# EasyEDA schematic schematic.easyeda.json
TITLE: Lunatic MIDI: PIC logic module; REV: 1.0; Date: 2019-03-29; Sheet: 1/1; Drawn By: Marco Zaccari; Company: Lunatic Electronics
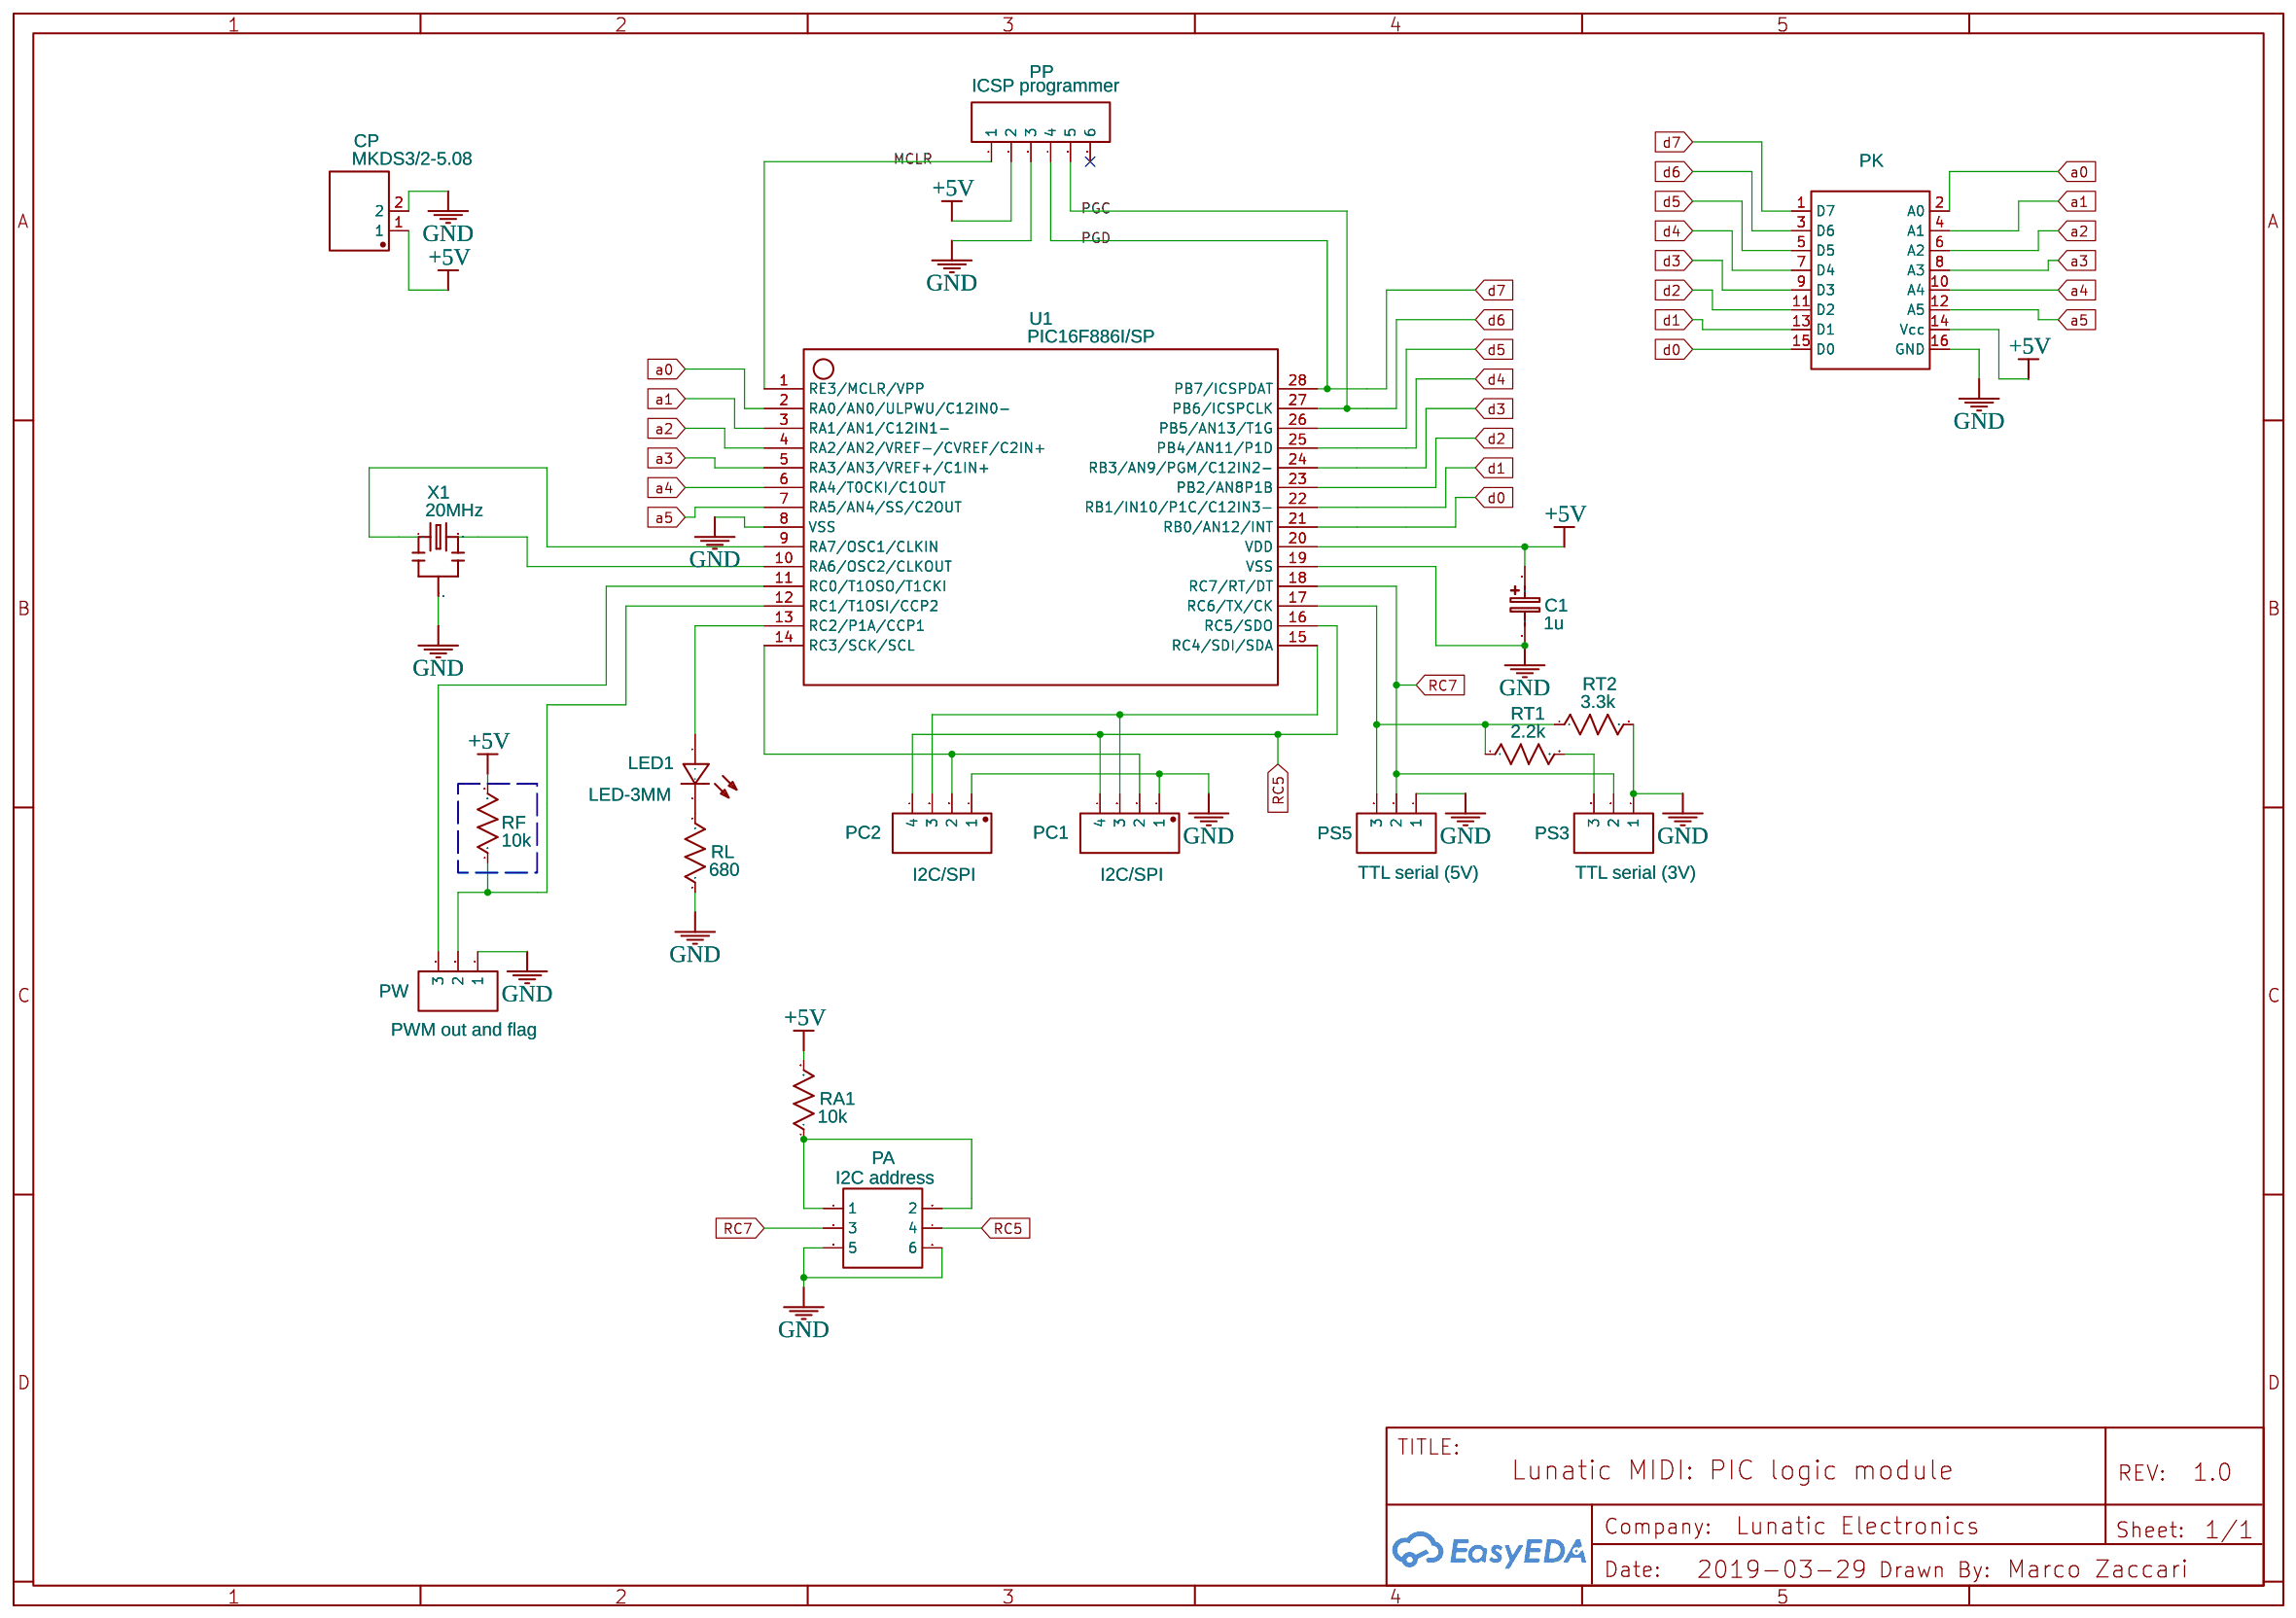
[diagram p0: schematic sheet]

## Parts
C1  1u  [CAP-D3.0XF1.5]
CP  MKDS3/2-5.08  [MKDS3/2-5.08]
LED1  LED-3MM  [LED-3MM/2.54]
PA  I2C address  [HDR-3X2/2.54]
PC1  I2C/SPI  [DIP-1X4P-2.54MM-M]
PC2  I2C/SPI  [DIP-1X4P-2.54MM-M]
PK  Lunatic MCU connector  [HDR-8X2/2.54]
PP  ICSP programmer  [HDR-6X1/2.54]
PS3  TTL serial (3V)  [HDR-3X1/2.54]
PS5  TTL serial (5V)  [HDR-3X1/2.54]
PW  PWM out and flag  [HDR-3X1/2.54]
RA1  10k  [AXIAL-0.3]
RF  10k  [AXIAL-0.3]
RL  680  [AXIAL-0.3]
RT1  2.2k  [AXIAL-0.3]
RT2  3.3k  [AXIAL-0.3]
U1  PIC16F886I/SP  [DIP-28_300MIL]
X1  20MHz  [RESONATOR-PTH]

## Library data of the parts
C1 = Cap_Electrolytic(TH)_D3.0XF1.5_EU: Contributor: EasyEDA; Manufacturer Part: ?
CP = -: Supplier: LCSC; Manufacturer: Phoenix Contact; Supplier Part: C89120
LED1 = -: Supplier Part: C99772; Supplier: LCSC; Manufacturer: EVERLIGHT; Manufacturer Part: 204-10SURD/S530-A3
PA = -: Supplier: LCSC; Manufacturer: BOOMELE; Manufacturer Part: Header-Male-2.54_2x3; Supplier Part: C65114
PC1 PC2 = -: Supplier: LCSC; Manufacturer: Ckmtw; Manufacturer Part: 210S-1*4P L=11.6MMGold-plated black; Contributor: LCSC; Supplier Part: C124378
PK = -: Manufacturer Part: GEM; image: //image.lceda.cn/szlcsc/C30734.jpg
PP = -: Supplier: LCSC; Manufacturer: BOOMELE; Manufacturer Part: Header-Male-2.54_1x6; Supplier Part: C37208
PS3 PS5 PW = -: Supplier: LCSC; Manufacturer: BOOMELE; Manufacturer Part: Header2.54mm 1*3P; image: //image.lceda.cn/szlcsc/C49257.jpg; Supplier Part: C49257
RA1 RF RL RT1 RT2 = Res_AXIAL-0.3(1/8W)_US: Manufacturer Part: ?
U1 = -: Supplier: LCSC; Manufacturer: MICROCHIP; image: //image.lceda.cn/szlcsc/C46335.jpg; Contributor: LCSC; Supplier Part: C46335
X1 = RESONATOR 433.92MHZ: Supplier: LCSC; Manufacturer: YXC; Manufacturer Part: Resonator 433.92MHZ; Contributor: LCSC; Supplier Part: C71016

## Nets
+5V: C1.1 CP.1 PK.14(Vcc) PP.2 RA1.2 RF.2 U1.20(VDD)
GND: C1.2 CP.2 PA.5 PA.6 PC1.1 PC2.1 PK.16(GND) PP.3 PS3.1 PS5.1 PW.1 RL.1 RT2.2 U1.8(VSS) U1.19(VSS) X1.2
a0: PK.2(A0) U1.2(RA0/AN0/ULPWU/C12IN0-)
a1: PK.4(A1) U1.3(RA1/AN1/C12IN1-)
a2: PK.6(A2) U1.4(RA2/AN2/VREF-/CVREF/C2IN+)
a3: PK.8(A3) U1.5(RA3/AN3/VREF+/C1IN+)
a4: PK.10(A4) U1.6(RA4/T0CKI/C1OUT)
a5: PK.12(A5) U1.7(RA5/AN4/SS/C2OUT)
d0: PK.15(D0) U1.21(RB0/AN12/INT)
d1: PK.13(D1) U1.22(RB1/IN10/P1C/C12IN3-)
d2: PK.11(D2) U1.23(PB2/AN8P1B)
d3: PK.9(D3) U1.24(RB3/AN9/PGM/C12IN2-)
d4: PK.7(D4) U1.25(PB4/AN11/P1D)
d5: PK.5(D5) U1.26(PB5/AN13/T1G)
MCLR: PP.1 U1.1(RE3/MCLR/VPP)
PGC: PK.3(D6) PP.5 U1.27(PB6/ICSPCLK)
PGD: PK.1(D7) PP.4 U1.28(PB7/ICSPDAT)
RC5: PA.4 PC1.4 PC2.4 U1.16(RC5/SDO)
RC7: PA.3 PS3.2 PS5.2 U1.18(RC7/RT/DT)
Net-(LED1-1): LED1.1(+) U1.13(RC2/P1A/CCP1)
Net-(LED1-2): LED1.2(-) RL.2
Net-(PA-1): PA.1 PA.2 RA1.1
Net-(PC1-2): PC1.2 PC2.2 U1.14(RC3/SCK/SCL)
Net-(PC1-3): PC1.3 PC2.3 U1.15(RC4/SDI/SDA)
Net-(PS3-3): PS3.3 RT1.2
Net-(PS5-3): PS5.3 RT1.1 RT2.1 U1.17(RC6/TX/CK)
Net-(PW-2): PW.2 RF.1 U1.12(RC1/T1OSI/CCP2)
Net-(PW-3): PW.3 U1.11(RC0/T1OSO/T1CKI)
Net-(U1-9): U1.9(RA7/OSC1/CLKIN) X1.1
Net-(U1-10): U1.10(RA6/OSC2/CLKOUT) X1.3

Not connected (* = marked no-connect by the designer): PP 6*
